# Altium project AUX_POWER_5V.PrjPCB
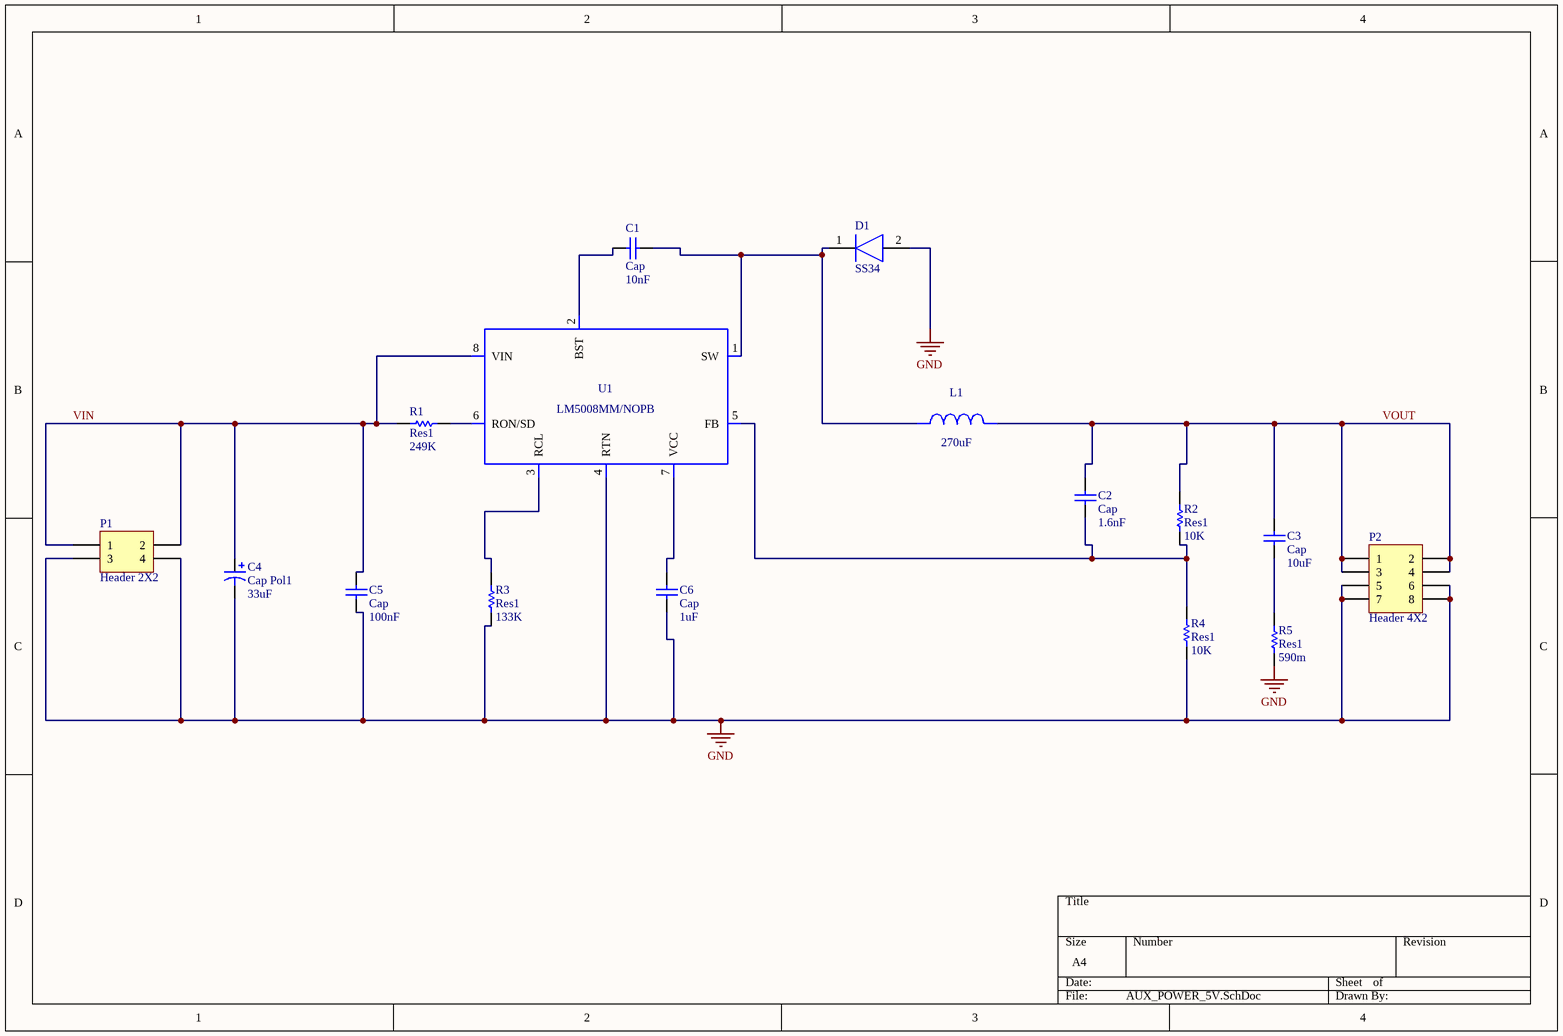
[diagram p0: AUX_POWER_5V.SchDoc]
1 sheet, 16 parts. Net scope: global (net labels, ports and power ports of the same name join across sheets).
Board file: AUX_POWER_5V.PcbDoc

## Sheet AUX_POWER_5V.SchDoc
size A4

### Parts
C1  Cap  value 10nF  [C0805]
C2  Cap  value 1.6nF  [C0805]
C3  Cap  value 10uF  [C0805]
C4  Cap Pol1  value 33uF  [C1206]
C5  Cap  value 100nF  [C0805]
C6  Cap  value 1uF  [C0805]
D1  SS34  [DIOM5026X262N]
L1  value 270uF  [INDUCTOR]  (hidden comment: SRU1048-331Y)
P1  Header 2X2  [HDR2X2]
P2  Header 4X2  [HDR2X4]
R1  Res1  value 249K  [1608[0603]]
R2  Res1  value 10K  [1608[0603]]
R3  Res1  value 133K  [1608[0603]]
R4  Res1  value 10K  [1608[0603]]
R5  Res1  value 590m  [1608[0603]]
U1  LM5008MM/NOPB  [SOP65P490X110-8N]

### Nets
GND: C4.2 C5.1 C6.1 D1.2(A) P1.3 P1.4 P2.5 P2.6 P2.7 P2.8 R3.1 R4.1 R5.1 U1.4(RTN)
VIN: C4.1 C5.2 P1.1 P1.2 R1.1 U1.8(VIN)
VOUT: C2.2 C3.2 L1.2 P2.1 P2.2 P2.3 P2.4 R2.2
NetC1_1: C1.1 D1.1(K) L1.1 U1.1(SW)
NetC1_2: C1.2 U1.2(BST)
NetC2_1: C2.1 R2.1 R4.2 U1.5(FB)
NetC3_1: C3.1 R5.2
NetC6_2: C6.2 U1.7(VCC)
NetR1_2: R1.2 U1.6(RON/SD)
NetR3_2: R3.2 U1.3(RCL)

### Library data of the parts
C1-C3 C5 C6 = Cap: Capacitor; Published: 8-Jun-2000; LatestRevisionDate: 17-Jul-2002; LatestRevisionNote: Re-released for DXP Platform.; PackageReference: RAD-0.3; Publisher: Altium Limited; PackageDescription: Radial Cap, Thru-Hole; 2 Leads; 0.3 in Pin Spacing
C4 = Cap Pol1: Polarized Capacitor (Radial); Published: 8-Jun-2000; LatestRevisionDate: 17-Jul-2002; LatestRevisionNote: Re-released for DXP Platform.; PackageReference: RB7.6-15; Publisher: Altium Limited; PackageDescription: Polarized Capacitor (Radial); 2 Leads
D1 = SS34: Diode; Manufacturer_Name: Fairchild Semiconductor; Datasheet Link: http://uk.rs-online.com/web/p/products/8080433; Height: 2.65mm; Manufacturer_Part_Number: SS34; Mouser Part Number: 512-SS34; Mouser Price/Stock: https://www.mouser.com/Search/Refine.aspx?Keyword=512-SS34
L1 = SRU1048-331Y: Manufacturer Name: Bourns; PackageReference: SRU1048-331Y; Manufacturer Part Number: SRU1048-331Y
P1 = Header 2X2: Header, 2-Pin, Dual row; LatestRevisionDate: 17-Jul-2002; LatestRevisionNote: Re-released for DXP Platform.; Publisher: Altium Limited
P2 = Header 4X2: Header, 4-Pin, Dual row; LatestRevisionDate: 17-Jul-2002; LatestRevisionNote: Re-released for DXP Platform.; Publisher: Altium Limited
R1-R5 = Res1: Resistor; Published: 8-Jun-2000; LatestRevisionDate: 17-Jul-2002; LatestRevisionNote: Re-released for DXP Platform.; PackageReference: AXIAL-0.3; Publisher: Altium Limited; PackageDescription: Axial Device, Thru-Hole; 2 Leads; 0.3 in Pin Spacing
U1 = LM5008MM/NOPB: Manufacturer Name: Texas Instruments; PackageReference: LM5008MM/NOPB; Manufacturer Part Number: LM5008MM/NOPB; Value: N/A